# Altium schematic sheet 485.SchDoc
size A4
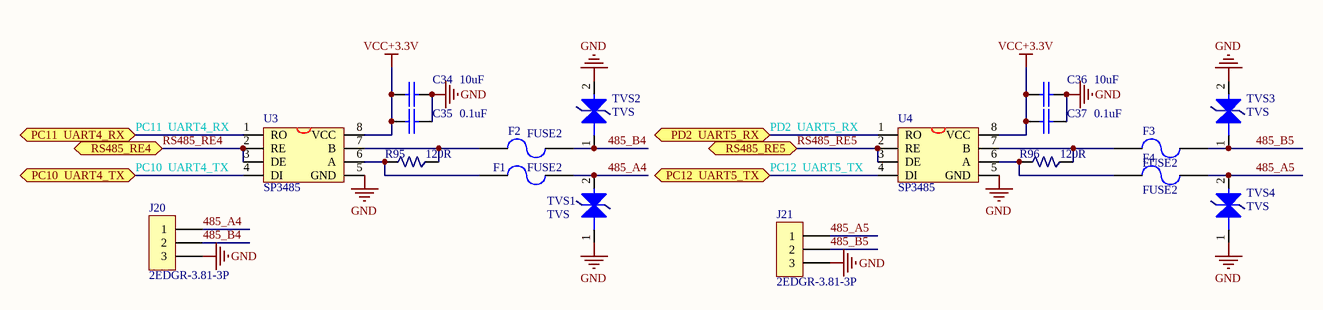
[diagram p0: 485.SchDoc]

## Parts
C34  10uF  [0805]
C35  0.1uF  [0603]
C36  10uF  [0805]
C37  0.1uF  [0603]
F1  FUSE2  [0805]
F2  FUSE2  [0805]
F3  FUSE2  [0805]
F4  FUSE2  [0805]
J20  2EDGR-3.81-3P  [3.81-3P]
J21  2EDGR-3.81-3P  [3.81-3P]
R95  120R  [0603]
R96  120R  [0603]
TVS1  TVS  [SMB]
TVS2  TVS  [SMB]
TVS3  TVS  [SMB]
TVS4  TVS  [SMB]
U3  SP3485  [SOP-8]
U4  SP3485  [SOP-8]

## Ports
PC10  UART4_TX, PC11  UART4_RX, PC12  UART5_TX, PD2  UART5_RX, RS485_RE4, RS485_RE5

## Nets
GND: C34.2 C35.2 C36.2 C37.2 J20.3 J21.3 TVS1.1(A) TVS2.2(K) TVS3.2(K) TVS4.1(A) U3.5(GND) U4.5(GND)
VCC+3.3V: C34.1 C35.1 C36.1 C37.1 U3.8(VCC) U4.8(VCC)
485_A4: F1.2 J20.1 TVS1.2(K)
485_A5: F4.2 J21.1 TVS4.2(K)
485_B4: F2.2 J20.2 TVS2.1(A)
485_B5: F3.2 J21.2 TVS3.1(A)
PC10  UART4_TX: U3.4(DI) ; port PC10  UART4_TX
PC11  UART4_RX: U3.1(RO) ; port PC11  UART4_RX
PC12  UART5_TX: U4.4(DI) ; port PC12  UART5_TX
PD2  UART5_RX: U4.1(RO) ; port PD2  UART5_RX
RS485_RE4: U3.2(RE) U3.3(DE) ; port RS485_RE4
RS485_RE5: U4.2(RE) U4.3(DE) ; port RS485_RE5
NetF1_1: F1.1 R95.2 U3.6(A)
NetF2_1: F2.1 R95.1 U3.7(B)
NetF3_1: F3.1 R96.1 U4.7(B)
NetF4_1: F4.1 R96.2 U4.6(A)

## Library data of the parts
C34-C37 = CAP
F1-F4 = FUSE2: SMD0805P010TS
J20 J21 = SIP3A-2.50（带槽）
R95 R96 = RES-1%: 高精度电阻
TVS1-TVS4 = TVS: SMBJ12CA
U3 U4 = MAX3485